# EAGLE design humidity_v2 (EAGLE 7.7.0)
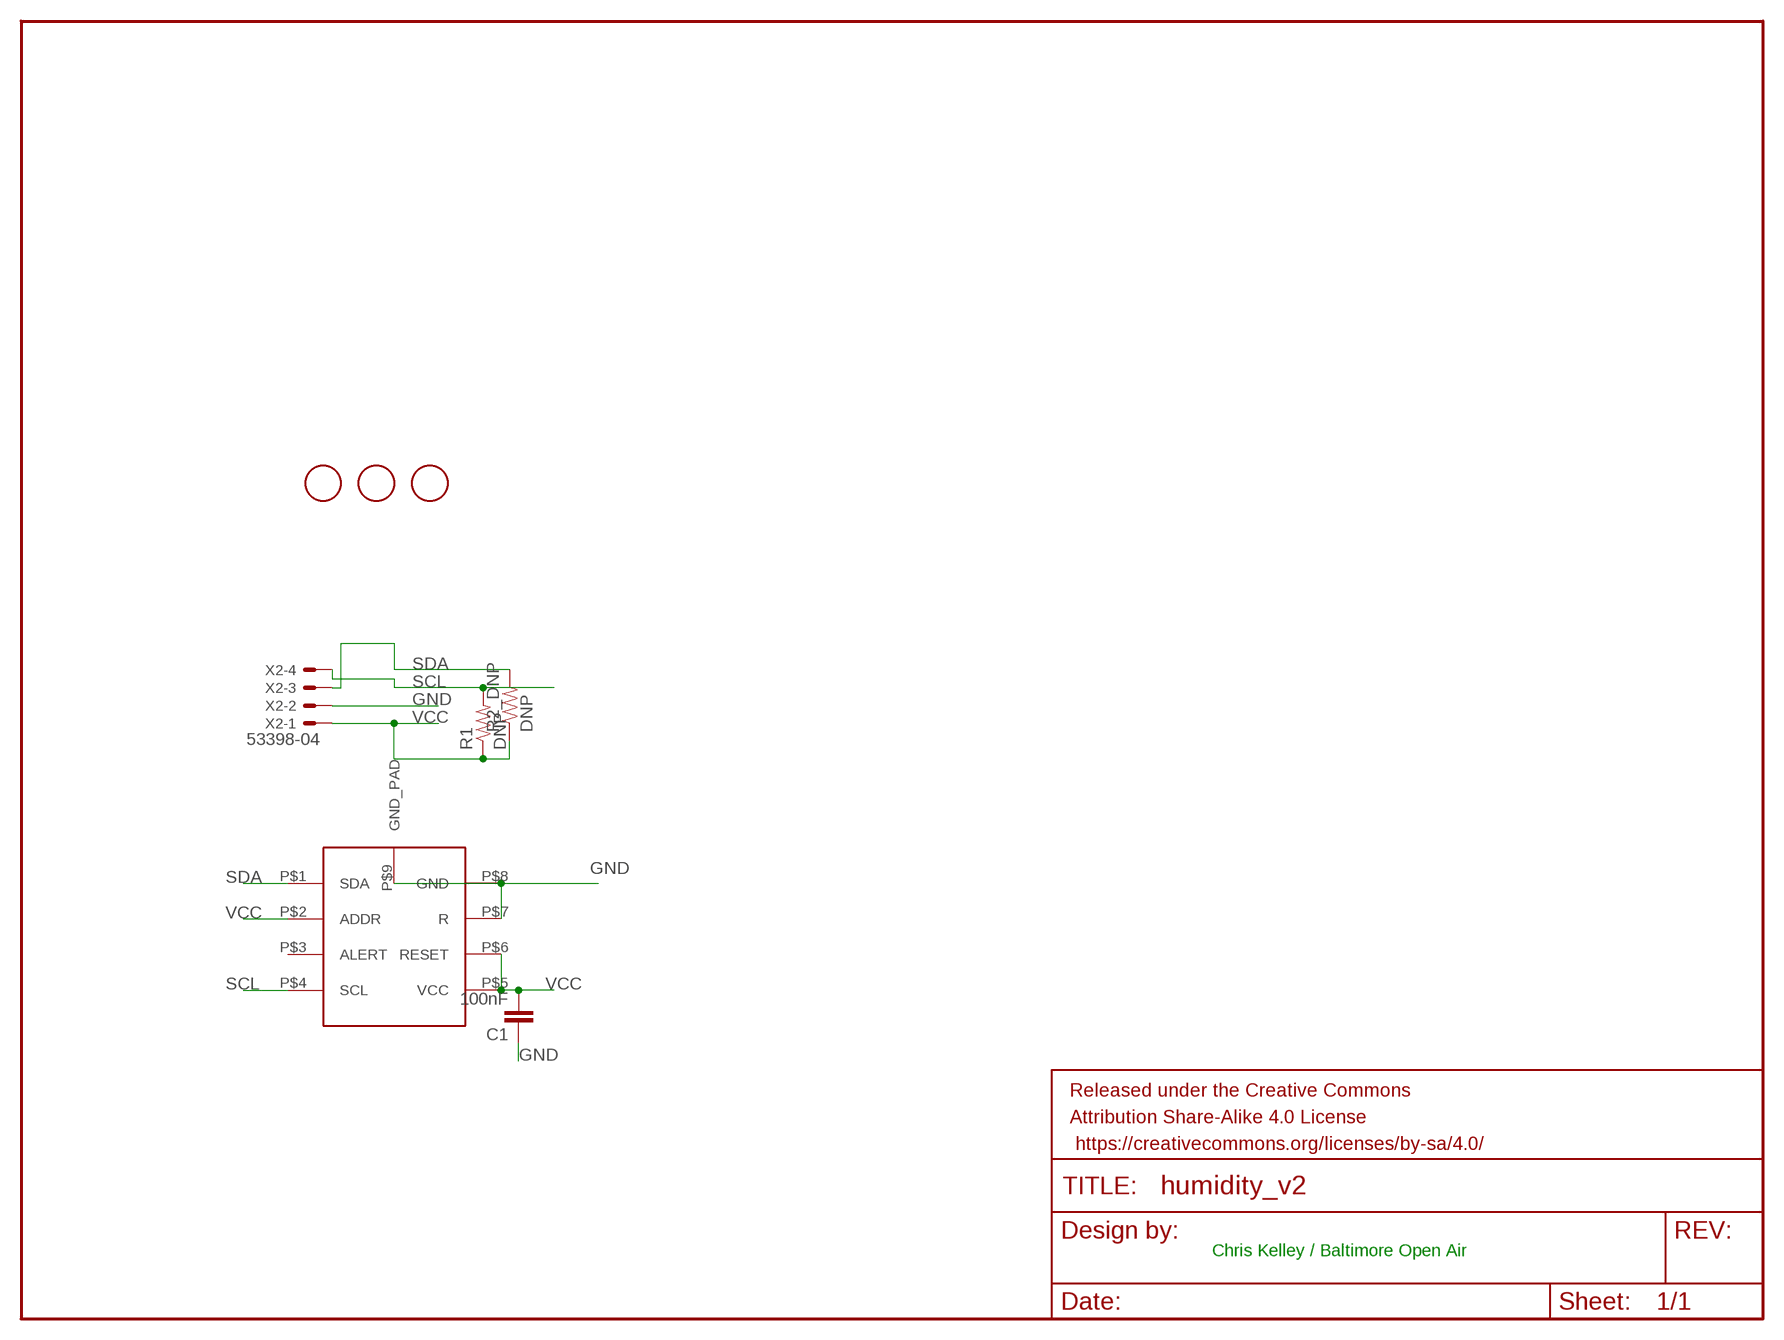
[diagram p0: schematic, sheet 1]

## Parts
C1  100nF  CAP0603-CAP  [0603-CAP]
FRAME1  FRAME-LETTER  [CREATIVE_COMMONS]
R1  DNP  RESISTOR0603-RES  [0603-RES]
R2_DNP  DNP  RESISTOR0603-RES  [0603-RES]
U$1  SHT31-D  [SHT31-D]
U$3  FIDUCIAL  [FIDUCIAL_1MM]
U$6  FIDUCIAL  [FIDUCIAL_1MM]
U$7  FIDUCIAL  [FIDUCIAL_1MM]
X2  53398-04  [53398-04]

## Nets
GND: C1.1 U$1.P$7(R) U$1.P$8(GND) U$1.P$9(GND_PAD) X2.2
SCL: R1.2 U$1.P$4(SCL) X2.4
SDA: R2_DNP.2 U$1.P$1(SDA) X2.3
VCC: C1.2 R1.1 R2_DNP.1 U$1.P$2(ADDR) U$1.P$5(VCC) U$1.P$6(RESET) X2.1
Unconnected: U$1.P$3(ALERT)

## Notes on the sheet
- Chris Kelley / Baltimore Open Air

## Library data of the parts
C1 = SparkFun-Passives:CAP: Capacitor Standard 0603 ceramic capacitor, and 0.1" leaded capacitor.
FRAME1 = SparkFun-Aesthetics:FRAME-LETTER: Schematic Frame Standard 8.5x11 US Letter frame
R1 R2_DNP = SparkFun-Passives:RESISTOR: Resistor Basic schematic elements and footprints for 0603, 1206, and PTH resistors.
U$1 = awqua_eagle_library:SHT31-D
U$3 U$6 U$7 = adafruit:FIDUCIAL: For use by pick and place machines to calibrate the vision/machine, 1mm By microbuilder.eu
X2 = con-molex:53?-04: CONNECTOR wire to board 1.25 mm (.049 inch) pitch header; OC_FARNELL: 1125367; OC_NEWARK: unknown

## Board
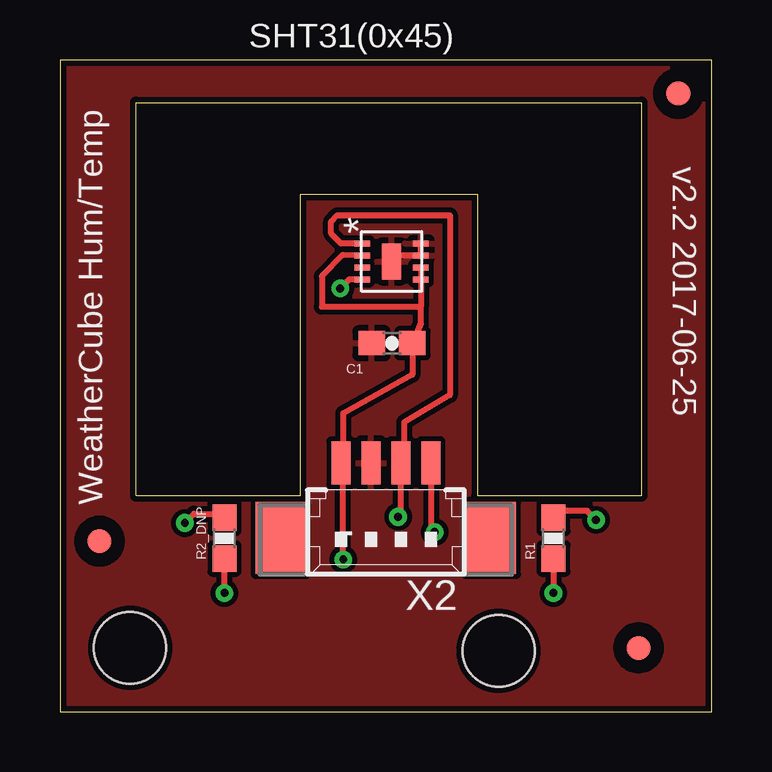
[diagram p1: board, top side]
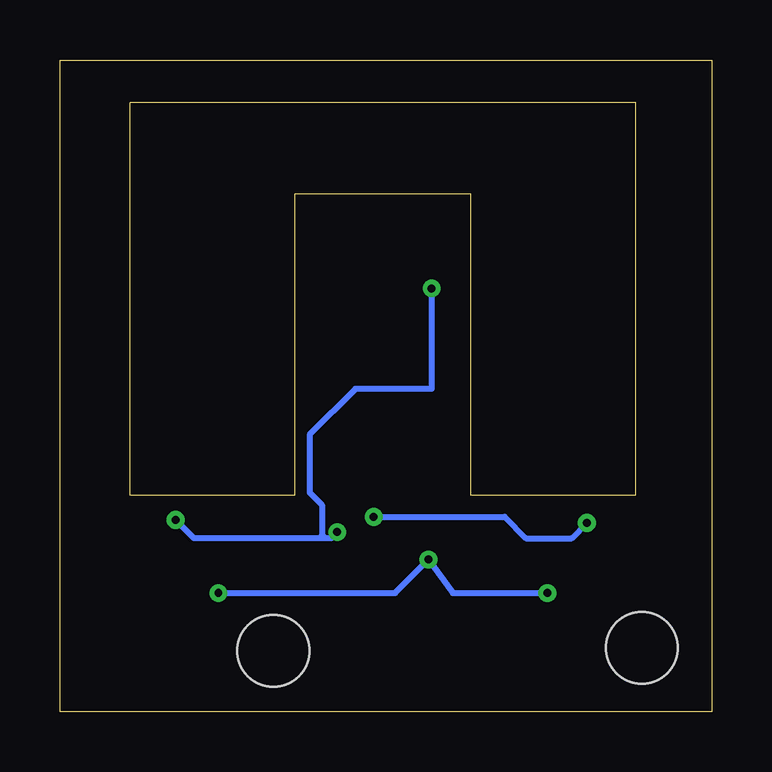
[diagram p2: board, bottom side, seen from below]

Size 27.18 x 27.18 mm. Coordinates in mm from the lower left corner, seen from the top.
Outline: 27.18,0 27.18,27.18 0,27.18 0,0 27.18,0
Outline: 3.17,9.02 3.17,25.4 24.26,25.4 24.26,9.02 17.4,9.02 17.4,21.59 10.03,21.59 10.03,9.02 3.17,9.02
Copper layers (1*16): Top 0.035mm / dielectric 1.5mm / Bottom 0.035mm
Design rules "default *": minimum track width 6mil, minimum drill 12mil, track to track 8mil, track to pad 8mil, pad to pad 8mil, via to via 8mil, smd to smd 8mil, copper to edge 10mil, drill to drill 8mil, minimum pad ring 10mil, minimum via ring 8mil, stop-mask expansion 4mil, vias tented up to drill 13mil, thermal gap 10mil
Holes 3 mm at 18.29,2.54 2.92,2.67

### Footprints (pad centres in the part's own frame; a part is rotated, then mirrored left to right if it is on the bottom)
0603-CAP = smd 1.1 x 1: 1 -0.85,0; 2 0.85,0
0603-RES = smd 1.1 x 1: 1 -0.85,0; 2 0.85,0
SHT31-D = smd 0.65 x 0.25: P$1 0.025,2; P$2 0.025,1.5; P$3 0.025,1; P$4 0.025,0.5; P$5 2.475,0.5; P$6 2.475,1; P$7 2.475,1.5; P$8 2.475,2 | smd 0.8 x 1.5: P$9 1.25,1.25
FIDUCIAL_1MM = smd 1 x 1: 1 0,0
53398-04 = smd 0.8 x 1.8: 1 1.875,-2.5; 2 0.625,-2.5; 3 -0.625,-2.5; 4 -1.875,-2.5 | smd 2.1 x 3: S1 4.375,0.625; S2 -4.375,0.625

### Placement (x,y rotation side)
C1  13.84,15.37 0 top
FRAME1  8.89,-15.75 0 top  (outside the outline)
R1  20.57,7.24 90 top
R2_DNP  6.86,7.24 90 top
U$1  12.57,17.53 0 top
U$3  1.65,7.11 0 top
U$6  25.78,25.78 0 top
U$7  24.13,2.67 0 top
X2  13.59,7.87 180 top

### Tracks (layer width: path | path; a pad name or v marks a point on that pad's centre or on a via)
GND
  Top 0.254: U$1.P$8 U$1.P$7 14.07,19.03 U$1.P$9 13.84,18.76
  pour Top: -2.67,30.73 30.1,30.73 29.84,-3.43 -2.92,-3.43
SCL  (via drill 0.33)
  Top 0.254: 15.59,7.52 v15.62,7.49 15.46,7.65 X2.4 | v22.35,8 21.97,8.38 20.87,8.38 R1.2 | U$1.P$4 12.06,18.03 v11.68,17.65
  Bottom 0.254: v15.62,7.49 15.88,7.24 16.13,7.24 | 16.13,7.24 21.59,7.24 v22.35,8 | v11.68,17.65 11.68,13.46 14.86,13.46 16.76,11.56 16.76,9.14 16.26,8.64 16.26,7.37 16.13,7.24
SDA  (via drill 0.33)
  Top 0.254: v5.21,7.87 5.59,8.26 6.69,8.26 R2_DNP.2 | U$1.P$1 11.72,19.53 11.3,19.94 11.3,20.45 11.56,20.7 16.26,20.7 16.26,13.21 14.35,12.06 14.35,10.51 X2.3 14.21,8.24 v14.1,8.13
  Bottom 0.254: v14.1,8.13 8.64,8.13 7.75,7.24 5.84,7.24 v5.21,7.87
VCC  (via drill 0.33)
  Top 0.254: U$1.P$6 U$1.P$5 15.05,16.89 | U$1.P$2 11.79,19.05 10.92,18.16 10.92,16.89 15.05,16.89 | v6.86,4.95 R2_DNP.1 | R1.1 v20.57,4.95 | 15.05,16.89 15.05,16.23 C1.2 14.69,14.06 11.81,12.45 11.81,10.47 X2.1 11.81,10.28 v11.81,6.35
  Bottom 0.254: v6.86,4.95 10.79,4.95 v11.81,6.35 13.21,4.95 v20.57,4.95

### Text on the board
tPlace: SHT31(0x45) | v2.2 2017-06-25 | * | WeatherCube Hum/Temp | -
tNames: Chris Kelley / Baltimore Open Air